# Altium schematic sheet Root.SchDoc
size B; SheetNumber: 1; SheetTotal: 2; SPICEModelCacheRYIKSWGO: <root> / <DocumentId>RYIKSWGO</DocumentId> / </root>
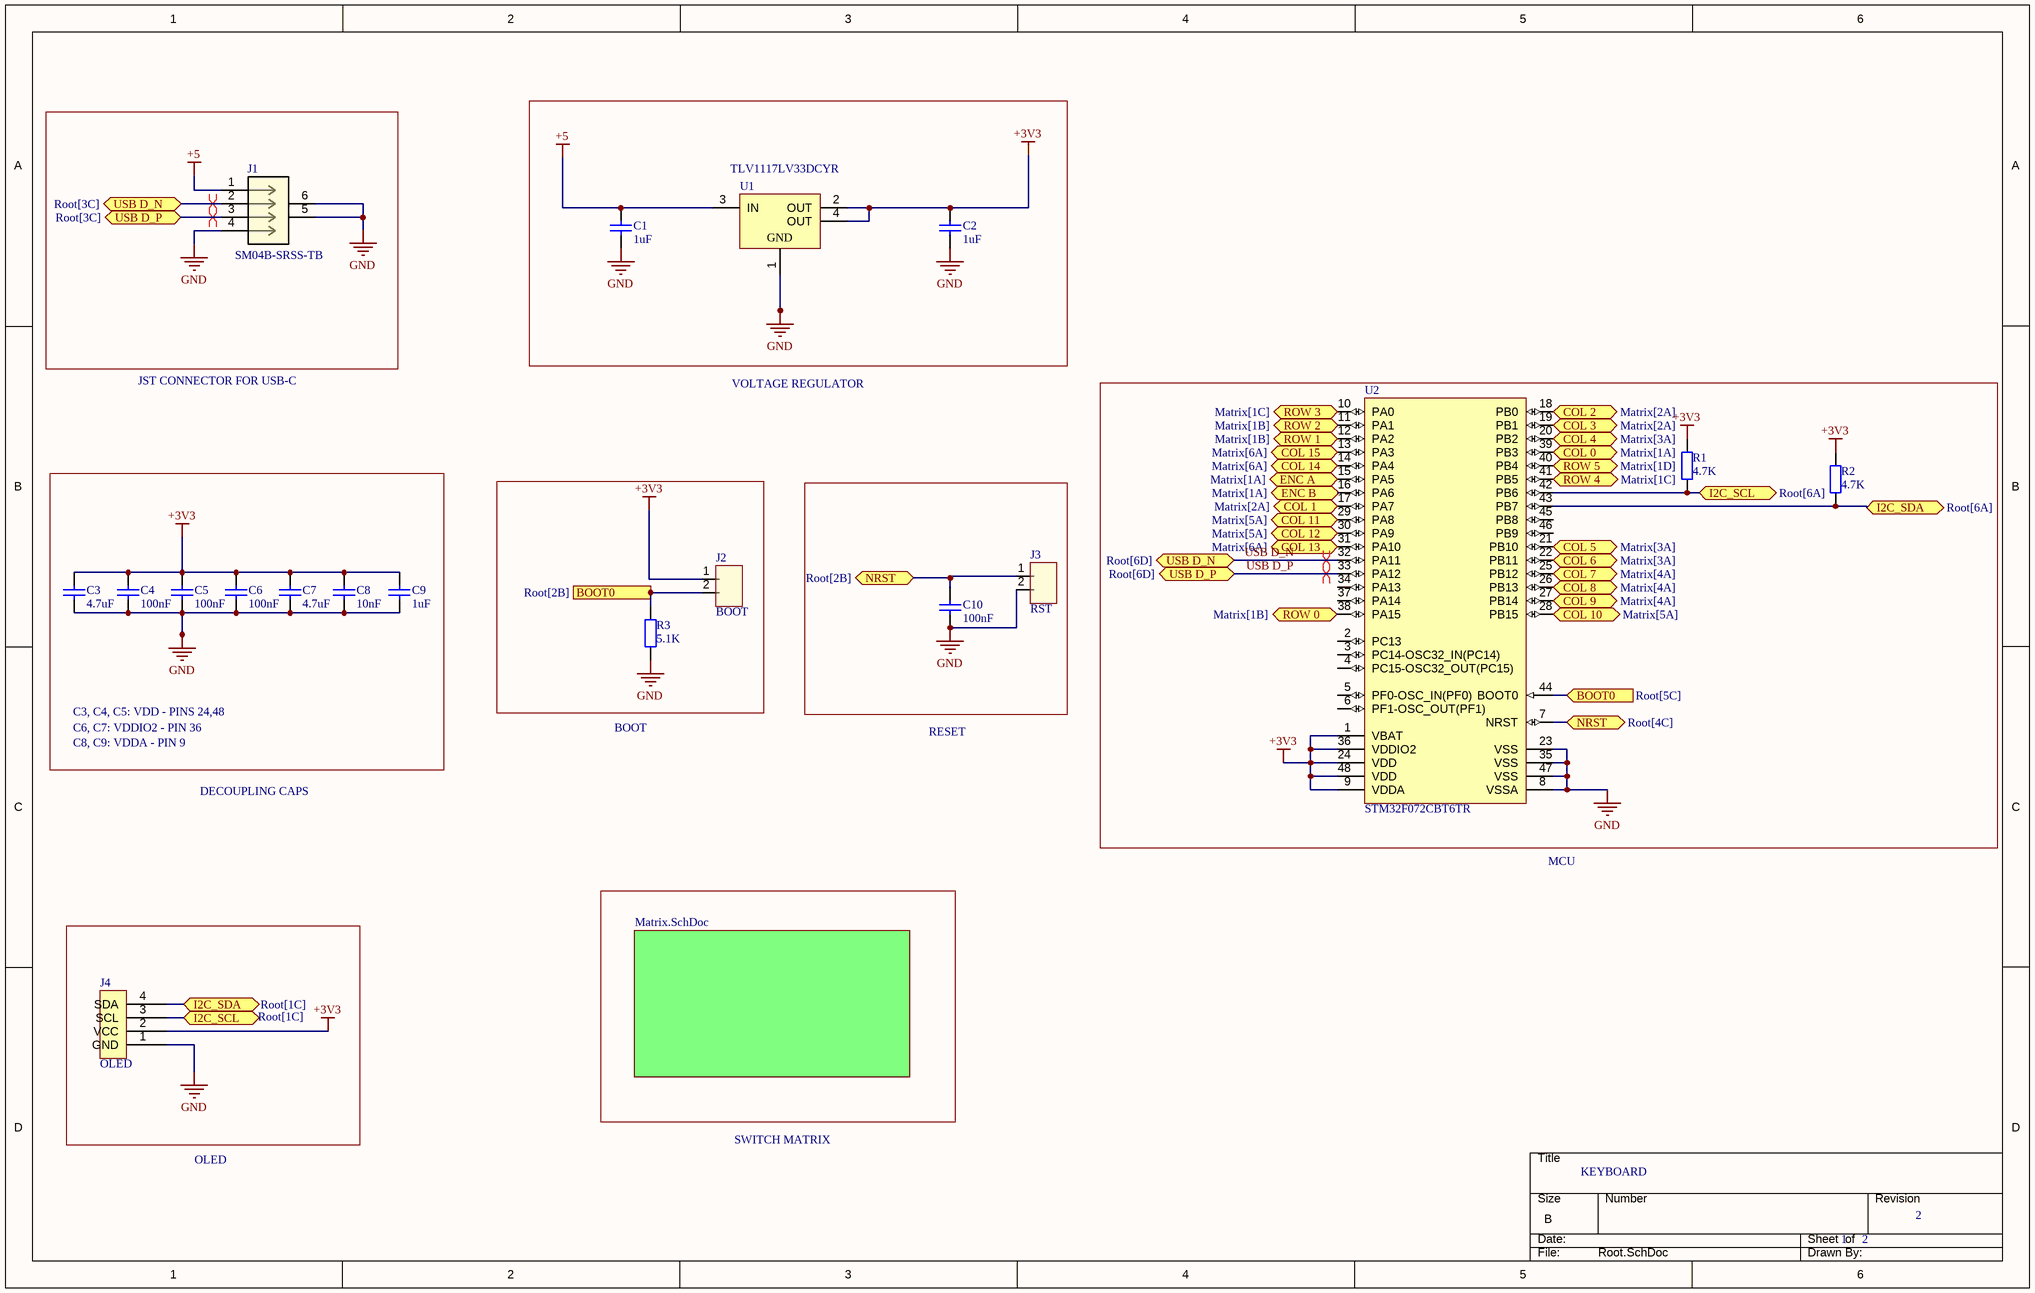
[diagram p0: Root.SchDoc]

## Parts
C1  value 1uF  [C0805]  (hidden comment: Cap)
C2  value 1uF  [C0805]  (hidden comment: Cap)
C3  value 4.7uF  [C0805]  (hidden comment: Cap)
C4  value 100nF  [C0805]  (hidden comment: Cap)
C5  value 100nF  [C0805]  (hidden comment: Cap)
C6  value 100nF  [C0805]  (hidden comment: Cap)
C7  value 4.7uF  [C0805]  (hidden comment: Cap)
C8  value 10nF  [C0805]  (hidden comment: Cap)
C9  value 1uF  [C0805]  (hidden comment: Cap)
C10  value 100nF  [C0805]  (hidden comment: Cap)
J1  SM04B-SRSS-TB  [JST-SR-4]
J2  BOOT  [HDR_1X2]
J3  RST  [HDR_1X2]
J4  OLED  [SSD1306-0.91-OLED-4pin-128x32]
R1  value 4.7K  [6-0805_M]  (hidden comment: Res2)
R2  value 4.7K  [6-0805_M]  (hidden comment: Res2)
R3  value 5.1K  [6-0805_M]  (hidden comment: Res2)
U1  TLV1117LV33DCYR  [DCY0004A_M]
U2  STM32F072CBT6TR  [STM-LQFP48_M]

## Sub-sheets
Matrix = Matrix.SchDoc: no entries

## Ports
BOOT0 (in, see Root[5C]), BOOT0 (out, see Root[2B]), COL 0 (bidir, see Matrix[1A]), COL 1 (bidir, see Matrix[2A]), COL 2 (bidir, see Matrix[2A]), COL 3 (bidir, see Matrix[2A]), COL 4 (bidir, see Matrix[3A]), COL 5 (bidir, see Matrix[3A]), COL 6 (bidir, see Matrix[3A]), COL 7 (bidir, see Matrix[4A]), COL 8 (bidir, see Matrix[4A]), COL 9 (bidir, see Matrix[4A]), COL 10 (bidir, see Matrix[5A]), COL 11 (bidir, see Matrix[5A]), COL 12 (bidir, see Matrix[5A]), COL 13 (bidir, see Matrix[6A]), COL 14 (bidir, see Matrix[6A]), COL 15 (bidir, see Matrix[6A]), ENC A (bidir, see Matrix[1A]), ENC B (bidir, see Matrix[1A]), I2C_SCL (bidir, see Root[1C]), I2C_SCL (bidir, see Root[6A]), I2C_SDA (bidir, see Root[1C]), I2C_SDA (bidir, see Root[6A]), NRST (bidir, see Root[2B]), NRST (bidir, see Root[4C]), ROW 0 (bidir, see Matrix[1B]), ROW 1 (bidir, see Matrix[1B]), ROW 2 (bidir, see Matrix[1B]), ROW 3 (bidir, see Matrix[1C]), ROW 4 (bidir, see Matrix[1C]), ROW 5 (bidir, see Matrix[1D]), USB D_N (bidir, see Root[3C]), USB D_N (bidir, see Root[6D]), USB D_P (bidir, see Root[3C]), USB D_P (bidir, see Root[6D])

## Nets
+3V3: C2.2 C3.2 C4.2 C5.2 C6.2 C7.2 C8.2 C9.2 J2.1 J4.2(VCC) R1.2 R2.2 U1.2(OUT) U1.4(OUT) U2.1(VBAT) U2.9(VDDA) U2.24(VDD) U2.36(VDDIO2) U2.48(VDD)
+5: C1.2 J1.1 U1.3(IN)
GND: C1.1 C2.1 C3.1 C4.1 C5.1 C6.1 C7.1 C8.1 C9.1 C10.1 J1.4 J1.5(MOUNT) J1.6(MOUNT) J3.2 J4.1(GND) R3.1 U1.1(GND) U2.8(VSSA) U2.23(VSS) U2.35(VSS) U2.47(VSS)
BOOT0: J2.2 R3.2 U2.44(BOOT0) ; port BOOT0
COL 0: U2.39(PB3) ; port COL 0
COL 1: U2.17(PA7) ; port COL 1
COL 2: U2.18(PB0) ; port COL 2
COL 3: U2.19(PB1) ; port COL 3
COL 4: U2.20(PB2) ; port COL 4
COL 5: U2.21(PB10) ; port COL 5
COL 6: U2.22(PB11) ; port COL 6
COL 7: U2.25(PB12) ; port COL 7
COL 8: U2.26(PB13) ; port COL 8
COL 9: U2.27(PB14) ; port COL 9
COL 10: U2.28(PB15) ; port COL 10
COL 11: U2.29(PA8) ; port COL 11
COL 12: U2.30(PA9) ; port COL 12
COL 13: U2.31(PA10) ; port COL 13
COL 14: U2.14(PA4) ; port COL 14
COL 15: U2.13(PA3) ; port COL 15
ENC A: U2.15(PA5) ; port ENC A
ENC B: U2.16(PA6) ; port ENC B
I2C_SCL: J4.3(SCL) R1.1 U2.42(PB6) ; port I2C_SCL
I2C_SDA: J4.4(SDA) R2.1 U2.43(PB7) ; port I2C_SDA
NRST: C10.2 J3.1 U2.7(NRST) ; port NRST
ROW 0: U2.38(PA15) ; port ROW 0
ROW 1: U2.12(PA2) ; port ROW 1
ROW 2: U2.11(PA1) ; port ROW 2
ROW 3: U2.10(PA0) ; port ROW 3
ROW 4: U2.41(PB5) ; port ROW 4
ROW 5: U2.40(PB4) ; port ROW 5
USB D_N: J1.2 U2.32(PA11) ; port USB D_N
USB D_P: J1.3 U2.33(PA12) ; port USB D_P

Not connected (* = marked no-connect by the designer): U2 2(PC13) 3(PC14-OSC32_IN(PC14)) 4(PC15-OSC32_OUT(PC15)) 5(PF0-OSC_IN(PF0)) 6(PF1-OSC_OUT(PF1)) 34(PA13) 37(PA14) 45(PB8) 46(PB9)

## Layout directives
differential pair: USB D_N, USB D_P

## Notes on the sheet
- JST CONNECTOR FOR USB-C
- VOLTAGE REGULATOR
- C3, C4, C5: VDD - PINS 24,48
- C6, C7: VDDIO2 - PIN 36
- C8, C9: VDDA - PIN 9
- BOOT
- RESET
- DECOUPLING CAPS
- MCU
- OLED
- SWITCH MATRIX
- KEYBOARD
- 1     2
- 2
- DWG. NO.
- REV.
- SHT.
- REVISION
- DESCRIPTION
- DATE
- APPROVED
- THIS DOCUMENT AND THE DATA DISCLOSED HEREIN OR HEREWITH IS THE PROPERTY OF ALTIUM LIMITED AND MAY BE FREELY DISTRIBUTED IN WHOLE. NO RIGHTS ARE RESERVED OR EXPRESS OR IMPLIED WARANTEE GIVEN.
- ENG:
- DSN:
- APPROVALS
- PROJECT
- DOCUMENT REVISION:
- DESIGN ITEM:
- CHK:
- BOM:
- REFERENCE DOCUMENTS
- PROJECT REVISION:
- TITLE
- FAB DWG:
- PCB DWG:
- ASSY DWG:
- SCALE:
- SIZE
- C
- CAGE CODE
- FILE NAME
- DWG NO.
- SHEET
- OF
- REV

## Library data of the parts
C1-C10 = Cap: Capacitor; Published: 8-Jun-2000; LatestRevisionDate: 17-Jul-2002; LatestRevisionNote: Re-released for DXP Platform.; PackageReference: RAD-0.3; Publisher: Altium Limited; PackageDescription: Radial Cap, Thru-Hole; 2 Leads; 0.3 in Pin Spacing
J1 = SM04B-SRSS-TB: No Description Available; Mfr_Name: JST; RefDes: RefDes; Type: Type
J2 J3 = CMP-002-00110-3: VALUE: HDRM2; Pins: 2; Design Item ID: HDR_1X2; Component Type: Standard; Source: Conn Header.SchLib
J4 = CMP-002-00072-5: 4 pin header
R1-R3 = Res2: Resistor; Published: 8-Jun-2000; LatestRevisionDate: 17-Jul-2002; LatestRevisionNote: Re-released for DXP Platform.; PackageReference: AXIAL-0.4; Publisher: Altium Limited; PackageDescription: Axial Device, Thru-Hole; 2 Leads; 0.4 in Pin Spacing
U1 = CMP-0395-00503-2: Single Output LDO, 1 A, Fixed 3.3 V Output, 2 to 5.5 V Input, 4-pin SOT-223 (DCY), -40 to 125 degC, Green (RoHS & no Sb/Br); Manufacturer: Texas Instruments; Vout Adj(Min)(V): 3.3; Vdo(Typ)(mV): 1200; Iq(Typ)(mA): 0.05; Accuracy(%): 2; Iout(Max)(A): 1; SubFamily: Single Channel LDO; Vin(Max)(V): 5.5; PackageReference: DCY0004A; PackageDescription: 4-Pin Plastic Small Outline, Body 3.5 x 6.5 mm, Pitch 2.3 mm; Vout Adj(Max)(V): 3.3; Mounting Technology: Surface Mount; ComponentLink2Description: Datasheet; ComponentLink1Description: Manufacturer URL; PartNumber: TLV1117LV33DCYR; ComponentLink3Description: Package Specification; ComponentLink1URL: http://www.ti.com/; ComponentLink2URL: http://www.ti.com/general/docs/lit/getliterature.tsp?genericPartNumber=TLV1117LV33&fileType=pdf; Fixed Output Options(V): 3.3; PackageVersion: 4202506/B; Vin(Min)(V): 2; DatasheetVersion: SBVS160A; Eco-Plan: Green (RoHS & no Sb/Br); ComponentLink3URL: http://www.ti.com/litv/pdf/mpds094a; Code_JEDEC: TO-261
U2 = CMP-0304-00171-1: ARM Cortex-M0 32-bit MCU, 128 KB Flash, 16 KB Internal RAM, 37 I/Os, 48-Pin LQFP, -40 to 85 degC, Tape and Reel; FLASH Size (Prog) (kB): 128; D/A Converter: 1; Operating Frequency(F) (Processor speed) (MHz): 48; Supply Voltage(Vcc) min (V): 2; I/Os (High Current): 37; Internal RAM Size (kB): 16; ComponentLink1URL: http://www.st.com/; DatasheetVersion: Rev. 5; Mounting Technology: Surface Mount; Packing: Tape and Reel; ComponentLink2Description: Datasheet; ComponentLink2URL: http://www.st.com/st-web-ui/static/active/en/resource/technical/document/datasheet/DM00090510.pdf; ComponentLink1Description: Manufacturer URL; Package Reference: LQFP48; Core: ARM Cortex-M0; Package Description: 48-Pin Low Profile Quad Flat Package, Body 7 x 7 mm, Pitch 0.5 mm